# Altium schematic sheet Vref.SchDoc
size A4; SheetNumber: 2; SheetTotal: 4
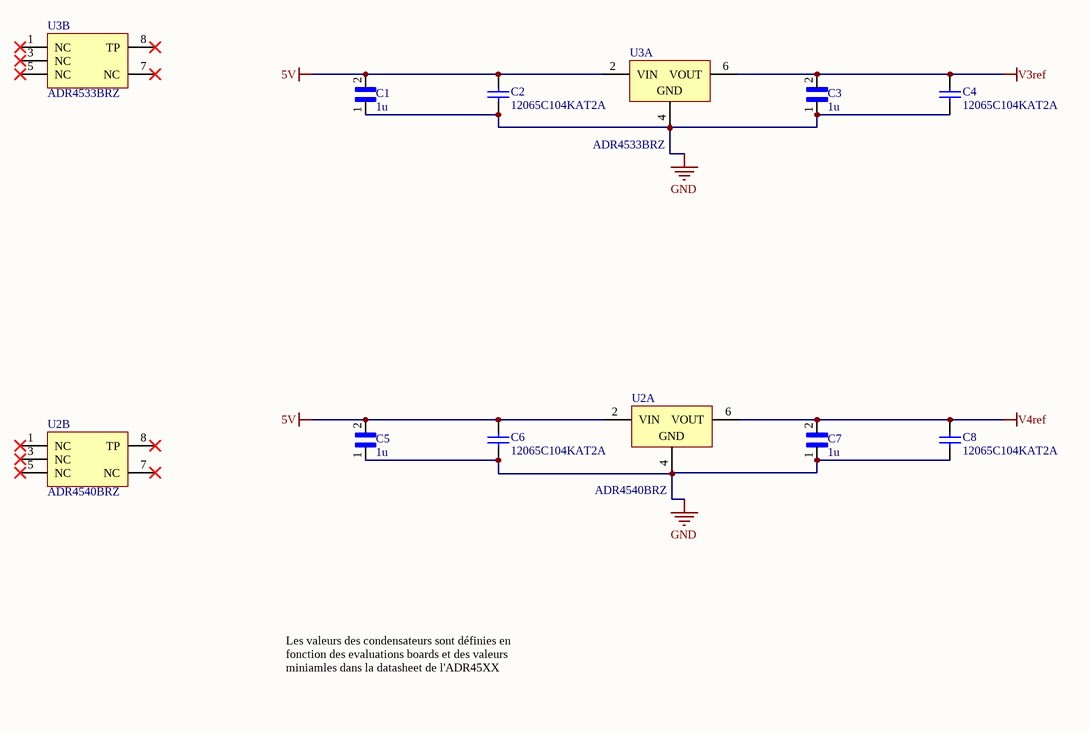
[diagram p0: Vref.SchDoc]

## Parts
C1  1u  [CAPC3216X127N]
C2  12065C104KAT2A  [CAPC3216X94X50ML20T25]
C3  1u  [CAPC3216X127N]
C4  12065C104KAT2A  [CAPC3216X94X50ML20T25]
C5  1u  [CAPC3216X127N]
C6  12065C104KAT2A  [CAPC3216X94X50ML20T25]
C7  1u  [CAPC3216X127N]
C8  12065C104KAT2A  [CAPC3216X94X50ML20T25]
U2  ADR4540BRZ  [ADI-R-8_M]  (parts A,B of 2)
U3  ADR4533BRZ  [ADI-R-8_L]  (parts A,B of 2)

## Nets
5V: C1.2 C2.1 C5.2 C6.1 U2.2(VIN) U3.2(VIN)
GND: C1.1 C2.2 C3.1 C4.2 C5.1 C6.2 C7.1 C8.2 U2.4(GND) U3.4(GND)
V3ref: C3.2 C4.1 U3.6(VOUT)
V4ref: C7.2 C8.1 U2.6(VOUT)

Not connected (* = marked no-connect by the designer): U2 1(NC)* 3(NC)* 5(NC)* 7(NC)* 8(TP)*; U3 1(NC)* 3(NC)* 5(NC)* 7(NC)* 8(TP)*

## Notes on the sheet
- Les valeurs des condensateurs sont définies en fonction des evaluations boards et des valeurs miniamles dans la datasheet de l'ADR45XX

## Library data of the parts
C1 C3 C5 C7 = 1206YC105KAT2A: Cap Ceramic 1uF 16V X7R 10% SMD 1206 125ÂÂŽ T/R; MF: {'manufacturer': u'AVX'}; Value: *; Package: None; MP: 1206YC105KAT2A; Price: None; Availability: Unavailable
C2 C4 C6 C8 = CMP-2000-05018-1: Chip Capacitor, Ceramic, 100 nF, 10%, 50 V, 1206, RoHS, Tape and Reel; Manufacturer: AVX; Rated Voltage: 50V; Dielectric: X7R; Capacitance: 100nF; Datasheet URL: http://www.mouser.com/ds/2/40/cauto-360.pdf; Manufacturer URL: http://www.avx.com/; Datasheet Version: Sep-14; Tolerance (%): ±10%; Case Size/Dimension: 1206
U2 = CMP-0784-00192-1: Ultralow Noise, High Accuracy Voltage Reference, 4.096 V Output, 3 to 15 V Supply, Industrial, 8-pin SOIC (R-8), Tube; Manufacturer: Analog Devices; Max V Supply (V): 15; Min V Supply (V): 3; Vout: 4.096V; Ref Out TC (ppm/C): 2; ComponentLink4URL: Product URL:http://www.analog.com/en/special-linear-functions/voltage-references/adr4540/products/product.html; Mounting Technology: Surface Mount; ComponentLink1Description: Manufacturer URL; PackageDescription: 8-Pin Standard Small Outline Package, Body 4.9 x 3.9 mm, Pitch 1.27 mm; ComponentLink2URL: http://www.analog.com/static/imported-files/data_sheets/ADR4520_4525_4530_4533_4540_4550.pdf; ComponentLink1URL: http://www.analog.com/en/index.html; DatasheetVersion: Rev. 0; ComponentLink4Description: URL Link1; Operating Temp Range: -40 to 125 degC; PartNumber: ADR4540BRZ; ComponentLink2Description: Datasheet; ComponentLink3URL: http://www.analog.com/static/imported-files/packages/PKG_PDF/SOIC_Narrow%20(R)/R_8.pdf; ComponentLink3Description: Package Specification; PackageVersion: 060506-A, 06/2006; Packing: Tube; PackageReference: R-8; Code_JEDEC: MS-012-AA
U3 = CMP-0784-00188-1: Ultralow Noise, High Accuracy Voltage Reference, 3.3 V Output, 3 to 15 V Supply, Industrial, 8-pin SOIC (R-8), Tube; Manufacturer: Analog Devices; Min V Supply (V): 3; Ref Out TC (ppm/C): 2; Max V Supply (V): 15; Vout: 3.3V; ComponentLink1URL: http://www.analog.com/en/index.html; ComponentLink3Description: Package Specification; Operating Temp Range: -40 to 125 degC; PartNumber: ADR4533BRZ; DatasheetVersion: Rev. 0; ComponentLink3URL: http://www.analog.com/static/imported-files/packages/PKG_PDF/SOIC_Narrow%20(R)/R_8.pdf; Packing: Tube; ComponentLink2URL: http://www.analog.com/static/imported-files/data_sheets/ADR4520_4525_4530_4533_4540_4550.pdf; Code_JEDEC: MS-012-AA; PackageVersion: 060506-A, 06/2006; ComponentLink4Description: URL Link1; ComponentLink1Description: Manufacturer URL; PackageReference: R-8; ComponentLink4URL: Product URL:http://www.analog.com/en/special-linear-functions/voltage-references/adr4533/products/product.html; PackageDescription: 8-Pin Standard Small Outline Package, Body 4.9 x 3.9 mm, Pitch 1.27 mm; ComponentLink2Description: Datasheet; Mounting Technology: Surface Mount